# Altium project Marsault1.PrjPcb (part 1 of 7)
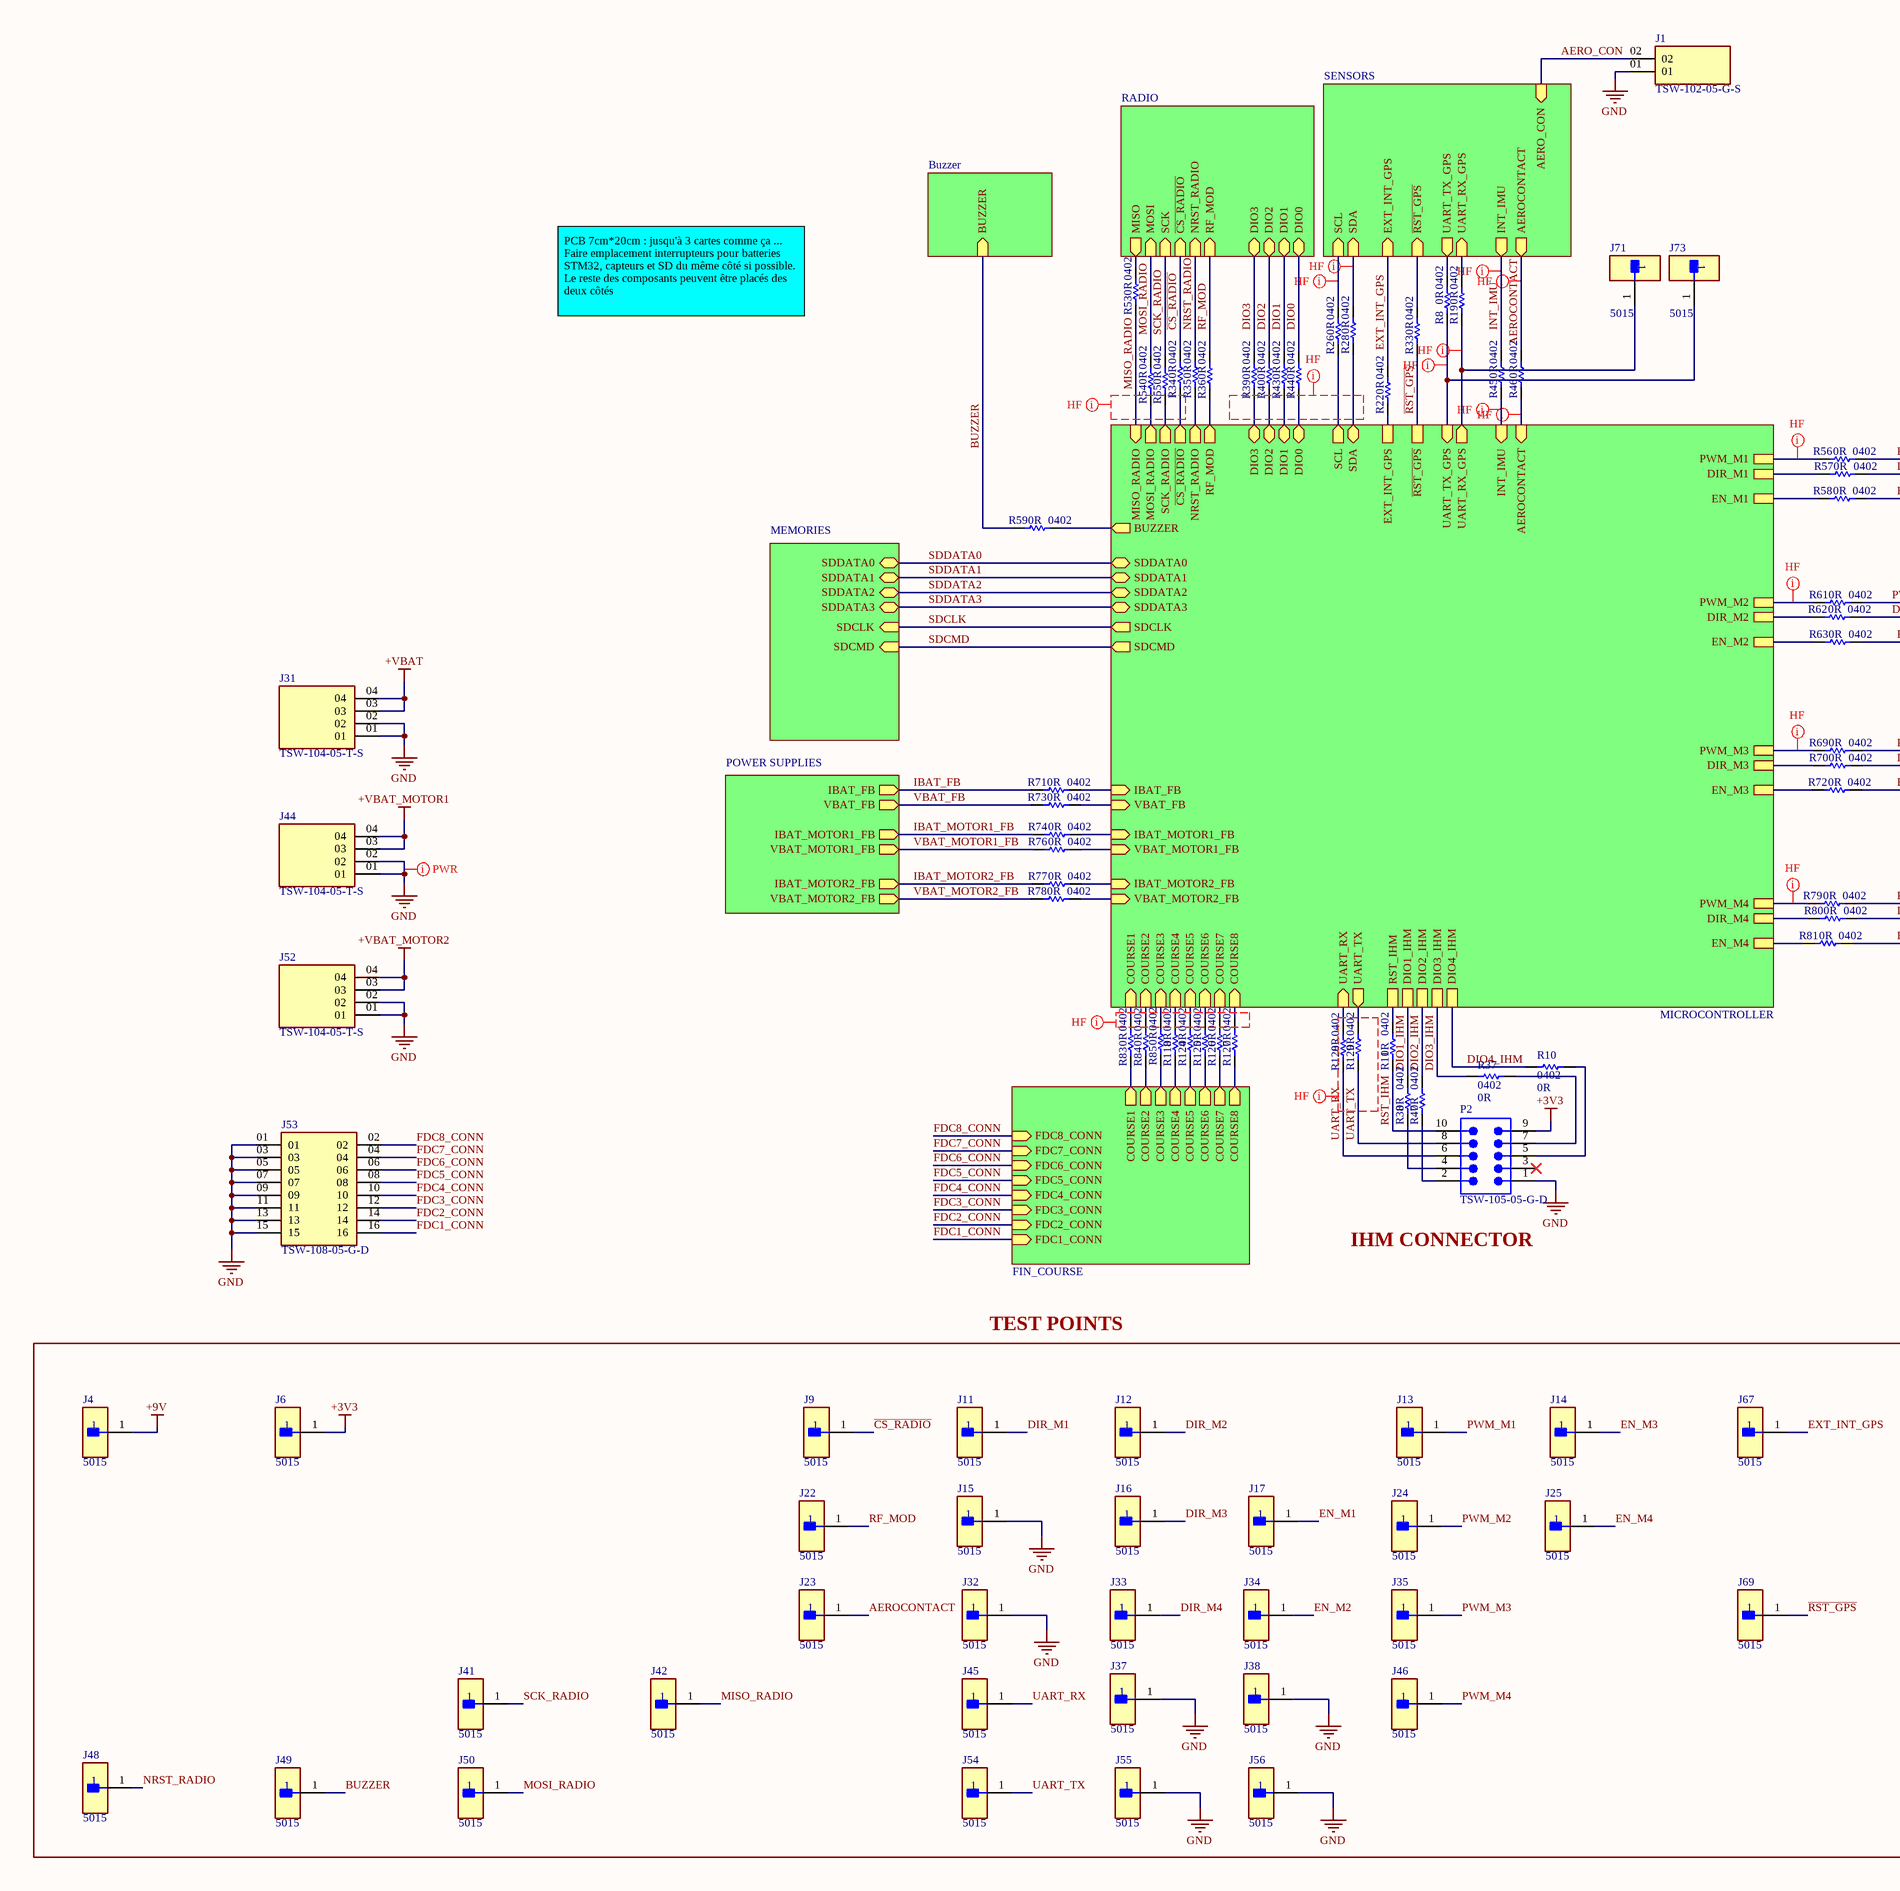
[diagram p0: MAIN.SchDoc, left]
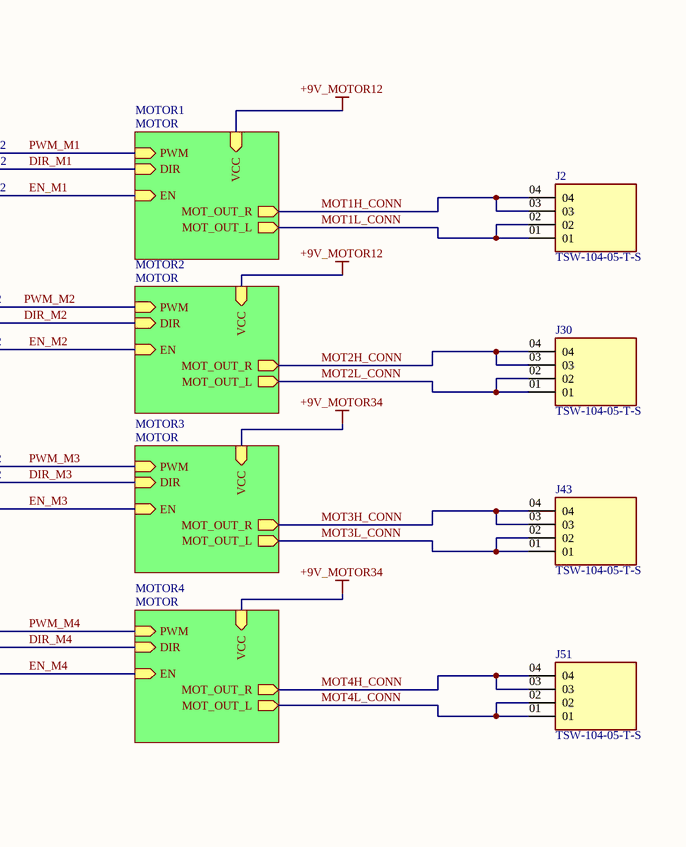
[diagram p1: MAIN.SchDoc, right]
9 sheets, 431 parts. Net scope: hierarchical (ports join the sheet entries above them; power ports are global).
Board file: PCB1.PcbDoc
Sheets:
  MAIN.SchDoc
    POWER SUPPLIES = POWER.SchDoc
    MEMORIES = MEMORIES.SchDoc
    MICROCONTROLLER = MICROCONTROLLER.SchDoc
    SENSORS = SENSORS.SchDoc
    MOTOR1 = MOTOR.SchDoc
    MOTOR2 = MOTOR.SchDoc
    MOTOR3 = MOTOR.SchDoc
    MOTOR4 = MOTOR.SchDoc
    RADIO = RADIO.SchDoc
    Buzzer = Buzzer.SchDoc
    FIN_COURSE = FIN_COURSE.SchDoc

## Sheet MAIN.SchDoc
size A2; SheetNumber: 1; SheetTotal: 9

### Parts
J1  TSW-102-05-G-S  [SAMTEC_TSW-102-05-G-S]
J2  TSW-104-05-T-S  [SAMTEC_TSW-104-05-T-S]
J4  5015  [FP-5015-MFG]
J6  5015  [FP-5015-MFG]
J9  5015  [FP-5015-MFG]
J11  5015  [FP-5015-MFG]
J12  5015  [FP-5015-MFG]
J13  5015  [FP-5015-MFG]
J14  5015  [FP-5015-MFG]
J15  5015  [FP-5015-MFG]
J16  5015  [FP-5015-MFG]
J17  5015  [FP-5015-MFG]
J22  5015  [FP-5015-MFG]
J23  5015  [FP-5015-MFG]
J24  5015  [FP-5015-MFG]
J25  5015  [FP-5015-MFG]
J30  TSW-104-05-T-S  [SAMTEC_TSW-104-05-T-S]
J31  TSW-104-05-T-S  [SAMTEC_TSW-104-05-T-S]
J32  5015  [FP-5015-MFG]
J33  5015  [FP-5015-MFG]
J34  5015  [FP-5015-MFG]
J35  5015  [FP-5015-MFG]
J37  5015  [FP-5015-MFG]
J38  5015  [FP-5015-MFG]
J41  5015  [FP-5015-MFG]
J42  5015  [FP-5015-MFG]
J43  TSW-104-05-T-S  [SAMTEC_TSW-104-05-T-S]
J44  TSW-104-05-T-S  [SAMTEC_TSW-104-05-T-S]
J45  5015  [FP-5015-MFG]
J46  5015  [FP-5015-MFG]
J48  5015  [FP-5015-MFG]
J49  5015  [FP-5015-MFG]
J50  5015  [FP-5015-MFG]
J51  TSW-104-05-T-S  [SAMTEC_TSW-104-05-T-S]
J52  TSW-104-05-T-S  [SAMTEC_TSW-104-05-T-S]
J53  TSW-108-05-G-D  [SAMTEC_TSW-108-05-G-D]
J54  5015  [FP-5015-MFG]
J55  5015  [FP-5015-MFG]
J56  5015  [FP-5015-MFG]
J67  5015  [FP-5015-MFG]
J69  5015  [FP-5015-MFG]
J71  5015  [FP-5015-MFG]
J73  5015  [FP-5015-MFG]
P2  TSW-105-05-G-D  [SMTC-TSW-105-05-X-D]
R8  Case Code (Imperial): 0402  Resistance: 0R  [RESC1005X40X25ML05T10]  (hidden comment: CRCW04020000Z0EDHP)
R10  Case Code (Imperial): 0402  Resistance: 0R  [RESC1005X40X25ML05T10]  (hidden comment: CRCW04020000Z0EDHP)
R11  Case Code (Imperial): 0402  Resistance: 0R  [RESC1005X40X25ML05T10]  (hidden comment: CRCW04020000Z0EDHP)
R19  Case Code (Imperial): 0402  Resistance: 0R  [RESC1005X40X25ML05T10]  (hidden comment: CRCW04020000Z0EDHP)
R22  Case Code (Imperial): 0402  Resistance: 0R  [RESC1005X40X25ML05T10]  (hidden comment: CRCW04020000Z0EDHP)
R26  Case Code (Imperial): 0402  Resistance: 0R  [RESC1005X40X25ML05T10]  (hidden comment: CRCW04020000Z0EDHP)
R28  Case Code (Imperial): 0402  Resistance: 0R  [RESC1005X40X25ML05T10]  (hidden comment: CRCW04020000Z0EDHP)
R33  Case Code (Imperial): 0402  Resistance: 0R  [RESC1005X40X25ML05T10]  (hidden comment: CRCW04020000Z0EDHP)
R34  Case Code (Imperial): 0402  Resistance: 0R  [RESC1005X40X25ML05T10]  (hidden comment: CRCW04020000Z0EDHP)
R35  Case Code (Imperial): 0402  Resistance: 0R  [RESC1005X40X25ML05T10]  (hidden comment: CRCW04020000Z0EDHP)
R36  Case Code (Imperial): 0402  Resistance: 0R  [RESC1005X40X25ML05T10]  (hidden comment: CRCW04020000Z0EDHP)
R37  Case Code (Imperial): 0402  Resistance: 0R  [RESC1005X40X25ML05T10]  (hidden comment: CRCW04020000Z0EDHP)
R38  Case Code (Imperial): 0402  Resistance: 0R  [RESC1005X40X25ML05T10]  (hidden comment: CRCW04020000Z0EDHP)
R39  Case Code (Imperial): 0402  Resistance: 0R  [RESC1005X40X25ML05T10]  (hidden comment: CRCW04020000Z0EDHP)
R40  Case Code (Imperial): 0402  Resistance: 0R  [RESC1005X40X25ML05T10]  (hidden comment: CRCW04020000Z0EDHP)
R43  Case Code (Imperial): 0402  Resistance: 0R  [RESC1005X40X25ML05T10]  (hidden comment: CRCW04020000Z0EDHP)
R44  Case Code (Imperial): 0402  Resistance: 0R  [RESC1005X40X25ML05T10]  (hidden comment: CRCW04020000Z0EDHP)
R45  Case Code (Imperial): 0402  Resistance: 0R  [RESC1005X40X25ML05T10]  (hidden comment: CRCW04020000Z0EDHP)
R46  Case Code (Imperial): 0402  Resistance: 0R  [RESC1005X40X25ML05T10]  (hidden comment: CRCW04020000Z0EDHP)
R47  Case Code (Imperial): 0402  Resistance: 0R  [RESC1005X40X25ML05T10]  (hidden comment: CRCW04020000Z0EDHP)
R53  Case Code (Imperial): 0402  Resistance: 0R  [RESC1005X40X25ML05T10]  (hidden comment: CRCW04020000Z0EDHP)
R54  Case Code (Imperial): 0402  Resistance: 0R  [RESC1005X40X25ML05T10]  (hidden comment: CRCW04020000Z0EDHP)
R55  Case Code (Imperial): 0402  Resistance: 0R  [RESC1005X40X25ML05T10]  (hidden comment: CRCW04020000Z0EDHP)
R56  Case Code (Imperial): 0402  Resistance: 0R  [RESC1005X40X25ML05T10]  (hidden comment: CRCW04020000Z0EDHP)
R57  Case Code (Imperial): 0402  Resistance: 0R  [RESC1005X40X25ML05T10]  (hidden comment: CRCW04020000Z0EDHP)
R58  Case Code (Imperial): 0402  Resistance: 0R  [RESC1005X40X25ML05T10]  (hidden comment: CRCW04020000Z0EDHP)
R59  Case Code (Imperial): 0402  Resistance: 0R  [RESC1005X40X25ML05T10]  (hidden comment: CRCW04020000Z0EDHP)
R61  Case Code (Imperial): 0402  Resistance: 0R  [RESC1005X40X25ML05T10]  (hidden comment: CRCW04020000Z0EDHP)
R62  Case Code (Imperial): 0402  Resistance: 0R  [RESC1005X40X25ML05T10]  (hidden comment: CRCW04020000Z0EDHP)
R63  Case Code (Imperial): 0402  Resistance: 0R  [RESC1005X40X25ML05T10]  (hidden comment: CRCW04020000Z0EDHP)
R69  Case Code (Imperial): 0402  Resistance: 0R  [RESC1005X40X25ML05T10]  (hidden comment: CRCW04020000Z0EDHP)
R70  Case Code (Imperial): 0402  Resistance: 0R  [RESC1005X40X25ML05T10]  (hidden comment: CRCW04020000Z0EDHP)
R71  Case Code (Imperial): 0402  Resistance: 0R  [RESC1005X40X25ML05T10]  (hidden comment: CRCW04020000Z0EDHP)
R72  Case Code (Imperial): 0402  Resistance: 0R  [RESC1005X40X25ML05T10]  (hidden comment: CRCW04020000Z0EDHP)
R73  Case Code (Imperial): 0402  Resistance: 0R  [RESC1005X40X25ML05T10]  (hidden comment: CRCW04020000Z0EDHP)
R74  Case Code (Imperial): 0402  Resistance: 0R  [RESC1005X40X25ML05T10]  (hidden comment: CRCW04020000Z0EDHP)
R76  Case Code (Imperial): 0402  Resistance: 0R  [RESC1005X40X25ML05T10]  (hidden comment: CRCW04020000Z0EDHP)
R77  Case Code (Imperial): 0402  Resistance: 0R  [RESC1005X40X25ML05T10]  (hidden comment: CRCW04020000Z0EDHP)
R78  Case Code (Imperial): 0402  Resistance: 0R  [RESC1005X40X25ML05T10]  (hidden comment: CRCW04020000Z0EDHP)
R79  Case Code (Imperial): 0402  Resistance: 0R  [RESC1005X40X25ML05T10]  (hidden comment: CRCW04020000Z0EDHP)
R80  Case Code (Imperial): 0402  Resistance: 0R  [RESC1005X40X25ML05T10]  (hidden comment: CRCW04020000Z0EDHP)
R81  Case Code (Imperial): 0402  Resistance: 0R  [RESC1005X40X25ML05T10]  (hidden comment: CRCW04020000Z0EDHP)
R83  Case Code (Imperial): 0402  Resistance: 0R  [RESC1005X40X25ML05T10]  (hidden comment: CRCW04020000Z0EDHP)
R84  Case Code (Imperial): 0402  Resistance: 0R  [RESC1005X40X25ML05T10]  (hidden comment: CRCW04020000Z0EDHP)
R85  Case Code (Imperial): 0402  Resistance: 0R  [RESC1005X40X25ML05T10]  (hidden comment: CRCW04020000Z0EDHP)
R118  Case Code (Imperial): 0402  Resistance: 0R  [RESC1005X40X25ML05T10]  (hidden comment: CRCW04020000Z0EDHP)
R124  Case Code (Imperial): 0402  Resistance: 0R  [RESC1005X40X25ML05T10]  (hidden comment: CRCW04020000Z0EDHP)
R125  Case Code (Imperial): 0402  Resistance: 0R  [RESC1005X40X25ML05T10]  (hidden comment: CRCW04020000Z0EDHP)
R126  Case Code (Imperial): 0402  Resistance: 0R  [RESC1005X40X25ML05T10]  (hidden comment: CRCW04020000Z0EDHP)
R127  Case Code (Imperial): 0402  Resistance: 0R  [RESC1005X40X25ML05T10]  (hidden comment: CRCW04020000Z0EDHP)
R128  Case Code (Imperial): 0402  Resistance: 0R  [RESC1005X40X25ML05T10]  (hidden comment: CRCW04020000Z0EDHP)
R129  Case Code (Imperial): 0402  Resistance: 0R  [RESC1005X40X25ML05T10]  (hidden comment: CRCW04020000Z0EDHP)

### Sub-sheets
Buzzer = Buzzer: BUZZER (in)
FIN_COURSE = FIN_COURSE: COURSE1 (out), COURSE8 (out), COURSE7 (out), COURSE6 (out), COURSE4 (out), COURSE2 (out), COURSE5 (out), COURSE3 (out), FDC8_CONN (in), FDC7_CONN (in), FDC6_CONN (in), FDC5_CONN (in), FDC4_CONN (in), FDC3_CONN (in), FDC2_CONN (in), FDC1_CONN (in)
MEMORIES = MEMORIES: SDDATA1 (bidir), SDCMD (in), SDDATA0 (bidir), SDDATA2 (bidir), SDCLK (in), SDDATA3 (bidir)
MICROCONTROLLER = MICROCONTROLLER: IBAT_FB (in), VBAT_FB (in), IBAT_MOTOR1_FB (in), VBAT_MOTOR1_FB (in), IBAT_MOTOR2_FB (in), VBAT_MOTOR2_FB (in), INT_IMU (in), DIO0 (bidir), DIO1 (bidir), DIO2 (bidir), DIO3 (bidir), RF_MOD (out), NRST_RADIO (out), ~{CS_RADIO} (out), SDDATA0 (bidir), SDDATA1 (bidir), SDDATA2 (bidir), SDDATA3 (bidir), SDCLK (out), SDCMD (out), AEROCONTACT (in), BUZZER (out), UART_RX (in), UART_TX (out), PWM_M1, DIR_M1, EN_M1, PWM_M2, DIR_M2, EN_M2, PWM_M3, DIR_M3, EN_M3, PWM_M4, DIR_M4, EN_M4, SCL (out), SDA (bidir), EXT_INT_GPS, ~{RST_GPS}, UART_TX_GPS (in), UART_RX_GPS (out), SCK_RADIO (out), MOSI_RADIO (out), MISO_RADIO (in), COURSE1 (in), COURSE2 (in), COURSE3 (in), COURSE4 (in), COURSE5 (in), COURSE6 (in), COURSE7 (in), COURSE8 (in), RST_IHM, DIO1_IHM, DIO2_IHM, DIO3_IHM, DIO4_IHM
MOTOR1 = MOTOR: DIR (in), PWM (in), EN (in), VCC (in), MOT_OUT_R (out), MOT_OUT_L (out)
MOTOR2 = MOTOR: EN (in), PWM (in), DIR (in), VCC (in), MOT_OUT_R (out), MOT_OUT_L (out)
MOTOR3 = MOTOR: EN (in), DIR (in), PWM (in), VCC (in), MOT_OUT_L (out), MOT_OUT_R (out)
MOTOR4 = MOTOR: PWM (in), EN (in), DIR (in), VCC (in), MOT_OUT_L (out), MOT_OUT_R (out)
POWER SUPPLIES = POWER: VBAT_FB (out), IBAT_MOTOR1_FB (out), VBAT_MOTOR1_FB (out), IBAT_FB (out), IBAT_MOTOR2_FB (out), VBAT_MOTOR2_FB (out)
RADIO = RADIO: ~{CS_RADIO} (in), DIO0 (bidir), DIO2 (bidir), NRST_RADIO (in), DIO1 (bidir), RF_MOD (in), DIO3 (bidir), SCK (in), MOSI (in), MISO (out)
SENSORS = SENSORS: INT_IMU (out), AEROCONTACT (out), SCL (in), SDA (in), EXT_INT_GPS (in), UART_TX_GPS (out), ~{RST_GPS} (in), UART_RX_GPS (in), AERO_CON (in)

### Nets
+3V3: J6.1 P2.9
+9V: J4.1
+9V_MOTOR12: sheet MOTOR1/VCC, sheet MOTOR2/VCC  [project net VCC_PWR]
+9V_MOTOR34: sheet MOTOR3/VCC, sheet MOTOR4/VCC  [project net VCC_PWR]
+VBAT: J31.03 J31.04
+VBAT_MOTOR1: J44.03 J44.04
+VBAT_MOTOR2: J52.03 J52.04
GND: J1.01 J15.1 J31.01 J31.02 J32.1 J37.1 J38.1 J44.01 J44.02 J52.01 J52.02 J53.01 J53.03 J53.05 J53.07 J53.09 J53.11 J53.13 J53.15 J55.1 J56.1 P2.1
~{CS_RADIO}: J9.1 R34.2 ; sheet RADIO/~{CS_RADIO}
~{RST_GPS}: J69.1 R33.1 ; sheet MICROCONTROLLER/~{RST_GPS}
~{RST_ihm}: R11.2 ; sheet MICROCONTROLLER/RST_IHM
AERO_CON: J1.02 ; sheet SENSORS/AERO_CON
AEROCONTACT: J23.1 R46.2 ; sheet SENSORS/AEROCONTACT
BUZZER: J49.1 R59.2 ; sheet Buzzer/BUZZER
DIO0: R44.2 ; sheet RADIO/DIO0
DIO1: R43.2 ; sheet RADIO/DIO1
DIO1_IHM: R38.2 ; sheet MICROCONTROLLER/DIO1_IHM
DIO2: R40.2 ; sheet RADIO/DIO2
DIO2_IHM: R47.2 ; sheet MICROCONTROLLER/DIO2_IHM
DIO3: R39.2 ; sheet RADIO/DIO3
DIO3_IHM: R37.2 ; sheet MICROCONTROLLER/DIO3_IHM
DIO4_IHM: R10.2 ; sheet MICROCONTROLLER/DIO4_IHM
DIR_M1: J11.1 R57.1 ; sheet MOTOR1/DIR
DIR_M2: J12.1 R62.1 ; sheet MOTOR2/DIR
DIR_M3: J16.1 R70.1 ; sheet MOTOR3/DIR
DIR_M4: J33.1 R80.1 ; sheet MOTOR4/DIR
EN_M1: J17.1 R58.1 ; sheet MOTOR1/EN
EN_M2: J34.1 R63.1 ; sheet MOTOR2/EN
EN_M3: J14.1 R72.1 ; sheet MOTOR3/EN
EN_M4: J25.1 R81.1 ; sheet MOTOR4/EN
EXT_INT_GPS: J67.1 R22.2 ; sheet SENSORS/EXT_INT_GPS
FDC1_CONN: J53.16 ; sheet FIN_COURSE/FDC1_CONN
FDC2_CONN: J53.14 ; sheet FIN_COURSE/FDC2_CONN
FDC3_CONN: J53.12 ; sheet FIN_COURSE/FDC3_CONN
FDC4_CONN: J53.10 ; sheet FIN_COURSE/FDC4_CONN
FDC5_CONN: J53.08 ; sheet FIN_COURSE/FDC5_CONN
FDC6_CONN: J53.06 ; sheet FIN_COURSE/FDC6_CONN
FDC7_CONN: J53.04 ; sheet FIN_COURSE/FDC7_CONN
FDC8_CONN: J53.02 ; sheet FIN_COURSE/FDC8_CONN
IBAT_FB: R71.2 ; sheet POWER SUPPLIES/IBAT_FB
IBAT_MOTOR1_FB: R74.2 ; sheet POWER SUPPLIES/IBAT_MOTOR1_FB
IBAT_MOTOR2_FB: R77.2 ; sheet POWER SUPPLIES/IBAT_MOTOR2_FB
INT_IMU: R45.2 ; sheet SENSORS/INT_IMU
MISO_RADIO: J42.1 R53.1 ; sheet MICROCONTROLLER/MISO_RADIO
MOSI_RADIO: J50.1 R54.2 ; sheet RADIO/MOSI
MOT1H_CONN: J2.03 J2.04 ; sheet MOTOR1/MOT_OUT_R  [project net HOT_R]
MOT1L_CONN: J2.01 J2.02 ; sheet MOTOR1/MOT_OUT_L  [project net HOT_L]
MOT2H_CONN: J30.03 J30.04 ; sheet MOTOR2/MOT_OUT_R  [project net HOT_R]
MOT2L_CONN: J30.01 J30.02 ; sheet MOTOR2/MOT_OUT_L  [project net HOT_L]
MOT3H_CONN: J43.03 J43.04 ; sheet MOTOR3/MOT_OUT_R  [project net HOT_R]
MOT3L_CONN: J43.01 J43.02 ; sheet MOTOR3/MOT_OUT_L  [project net HOT_L]
MOT4H_CONN: J51.03 J51.04 ; sheet MOTOR4/MOT_OUT_R  [project net HOT_R]
MOT4L_CONN: J51.01 J51.02 ; sheet MOTOR4/MOT_OUT_L  [project net HOT_L]
NRST_RADIO: J48.1 R35.2 ; sheet RADIO/NRST_RADIO
PWM_M1: J13.1 R56.1 ; sheet MOTOR1/PWM
PWM_M2: J24.1 R61.1 ; sheet MOTOR2/PWM
PWM_M3: J35.1 R69.1 ; sheet MOTOR3/PWM
PWM_M4: J46.1 R79.1 ; sheet MOTOR4/PWM
RF_MOD: J22.1 R36.2 ; sheet RADIO/RF_MOD
RST_IHM: P2.10 R11.1
SCK_RADIO: J41.1 R55.2 ; sheet RADIO/SCK
SDCLK: sheet MEMORIES/SDCLK, sheet MICROCONTROLLER/SDCLK
SDCMD: sheet MEMORIES/SDCMD, sheet MICROCONTROLLER/SDCMD
SDDATA0: sheet MEMORIES/SDDATA0, sheet MICROCONTROLLER/SDDATA0
SDDATA1: sheet MEMORIES/SDDATA1, sheet MICROCONTROLLER/SDDATA1
SDDATA2: sheet MEMORIES/SDDATA2, sheet MICROCONTROLLER/SDDATA2
SDDATA3: sheet MEMORIES/SDDATA3, sheet MICROCONTROLLER/SDDATA3
UART_RX: J45.1 P2.6 R128.1
UART_TX: J54.1 P2.8 R129.1
VBAT_FB: R73.2 ; sheet POWER SUPPLIES/VBAT_FB
VBAT_MOTOR1_FB: R76.2 ; sheet POWER SUPPLIES/VBAT_MOTOR1_FB
VBAT_MOTOR2_FB: R78.2 ; sheet POWER SUPPLIES/VBAT_MOTOR2_FB
NetIC9_8: R33.2 ; sheet SENSORS/~{RST_GPS}
NetIC9_20: R8.2 ; sheet SENSORS/UART_TX_GPS
NetIC9_21: R19.2 ; sheet SENSORS/UART_RX_GPS
NetIC10_11: R127.1 ; sheet FIN_COURSE/COURSE8
NetIC10_12: R126.1 ; sheet FIN_COURSE/COURSE7
NetIC10_13: R125.1 ; sheet FIN_COURSE/COURSE6
NetIC10_14: R124.1 ; sheet FIN_COURSE/COURSE5
NetIC10_15: R118.1 ; sheet FIN_COURSE/COURSE4
NetIC10_16: R85.1 ; sheet FIN_COURSE/COURSE3
NetIC10_17: R84.1 ; sheet FIN_COURSE/COURSE2
NetIC10_18: R83.1 ; sheet FIN_COURSE/COURSE1
NetJ70_1: R28.2 ; sheet SENSORS/SDA
NetJ71_1: J71.1 R19.1 ; sheet MICROCONTROLLER/UART_RX_GPS
NetJ72_1: R26.2 ; sheet SENSORS/SCL
NetJ73_1: J73.1 R8.1 ; sheet MICROCONTROLLER/UART_TX_GPS
NetP2_2: P2.2 R47.1
NetP2_4: P2.4 R38.1
NetP2_5: P2.5 R10.1
NetP2_7: P2.7 R37.1
NetR22_1: R22.1 ; sheet MICROCONTROLLER/EXT_INT_GPS
NetR26_1: R26.1 ; sheet MICROCONTROLLER/SCL
NetR28_1: R28.1 ; sheet MICROCONTROLLER/SDA
NetR34_1: R34.1 ; sheet MICROCONTROLLER/~{CS_RADIO}
NetR35_1: R35.1 ; sheet MICROCONTROLLER/NRST_RADIO
NetR36_1: R36.1 ; sheet MICROCONTROLLER/RF_MOD
NetR39_1: R39.1 ; sheet MICROCONTROLLER/DIO3
NetR40_1: R40.1 ; sheet MICROCONTROLLER/DIO2
NetR43_1: R43.1 ; sheet MICROCONTROLLER/DIO1
NetR44_1: R44.1 ; sheet MICROCONTROLLER/DIO0
NetR45_1: R45.1 ; sheet MICROCONTROLLER/INT_IMU
NetR46_1: R46.1 ; sheet MICROCONTROLLER/AEROCONTACT
NetR53_2: R53.2 ; sheet RADIO/MISO
NetR54_1: R54.1 ; sheet MICROCONTROLLER/MOSI_RADIO
NetR55_1: R55.1 ; sheet MICROCONTROLLER/SCK_RADIO
NetR56_2: R56.2 ; sheet MICROCONTROLLER/PWM_M1
NetR57_2: R57.2 ; sheet MICROCONTROLLER/DIR_M1
NetR58_2: R58.2 ; sheet MICROCONTROLLER/EN_M1
NetR59_1: R59.1 ; sheet MICROCONTROLLER/BUZZER
NetR61_2: R61.2 ; sheet MICROCONTROLLER/PWM_M2
NetR62_2: R62.2 ; sheet MICROCONTROLLER/DIR_M2
NetR63_2: R63.2 ; sheet MICROCONTROLLER/EN_M2
NetR69_2: R69.2 ; sheet MICROCONTROLLER/PWM_M3
NetR70_2: R70.2 ; sheet MICROCONTROLLER/DIR_M3
NetR71_1: R71.1 ; sheet MICROCONTROLLER/IBAT_FB
NetR72_2: R72.2 ; sheet MICROCONTROLLER/EN_M3
NetR73_1: R73.1 ; sheet MICROCONTROLLER/VBAT_FB
NetR74_1: R74.1 ; sheet MICROCONTROLLER/IBAT_MOTOR1_FB
NetR76_1: R76.1 ; sheet MICROCONTROLLER/VBAT_MOTOR1_FB
NetR77_1: R77.1 ; sheet MICROCONTROLLER/IBAT_MOTOR2_FB
NetR78_1: R78.1 ; sheet MICROCONTROLLER/VBAT_MOTOR2_FB
NetR79_2: R79.2 ; sheet MICROCONTROLLER/PWM_M4
NetR80_2: R80.2 ; sheet MICROCONTROLLER/DIR_M4
NetR81_2: R81.2 ; sheet MICROCONTROLLER/EN_M4
NetR83_2: R83.2 ; sheet MICROCONTROLLER/COURSE1
NetR84_2: R84.2 ; sheet MICROCONTROLLER/COURSE2
NetR85_2: R85.2 ; sheet MICROCONTROLLER/COURSE3
NetR118_2: R118.2 ; sheet MICROCONTROLLER/COURSE4
NetR124_2: R124.2 ; sheet MICROCONTROLLER/COURSE5
NetR125_2: R125.2 ; sheet MICROCONTROLLER/COURSE6
NetR126_2: R126.2 ; sheet MICROCONTROLLER/COURSE7
NetR127_2: R127.2 ; sheet MICROCONTROLLER/COURSE8
NetR128_2: R128.2 ; sheet MICROCONTROLLER/UART_RX
NetR129_2: R129.2 ; sheet MICROCONTROLLER/UART_TX

Not connected (* = marked no-connect by the designer): P2 3*

### Layout directives
net class HF: (no net found under the mark), AEROCONTACT, INT_IMU, NetJ70_1, NetJ71_1, NetJ72_1, NetJ73_1, NetR45_1, NetR46_1, NetR56_2, NetR61_2, NetR69_2, NetR79_2
net class PWR: GND

### Notes on the sheet
- PCB 7cm*20cm : jusqu'à 3 cartes comme ça ...
  Faire emplacement interrupteurs pour batteries
  STM32, capteurs et SD du même côté si possible. Le reste des composants peuvent être placés des deux côtés
- (near P2) IHM CONNECTOR
- TEST POINTS

### Library data of the parts
J1 = TSW-102-05-G-S: MF: {'manufacturer': u'Samtec Inc.'}; MP: TSW-102-05-G-S; Price: None; Package: None; Value: *; Availability: Unavailable
J2 J30 J31 J43 J44 J51 J52 = TSW-104-05-T-S: MF: {'manufacturer': u'Samtec'}; MP: TSW-104-05-T-S; Price: None; Package: None; Value: *; Availability: Unavailable
J4 J6 J9 J11-J17 J22-J25 J32-J35 J37 J38 J41 J42 J45 J46 J48-J50 J54-J56 J67 J69 J71 J73 = CMP-2000-05183-2: PC TEST POINT MINIATURE; Manufacturer: keystone; Number Of Contacts: 1; Conn Orientation: Straight; Category: Conn; Manufacturer Part Number: 5015; Digikey Description: PC TEST POINT MINIATURE; Automotive: No; Lead Free: Yes; Octopart: https://octopart.com/5015-keystone-3822; ComponentLink2URL: http://www.keyelco.com/product-pdf.cfm?p=1353; Package: 5015; RoHS: TRUE; Device Class L3: unset; Device Class L2: unset; Contact Material: Silver; Device Class L1: Connectors; Height: 1.65mm; ComponentLink2Description: Datasheet; Supplier 1: Mouser; Supplier Part Number 1: 534-5015; Stock 1: 1597055; Pricing 1: 1=0,45000, 10=0,43800, 25=0,36500, 50=0,36500, 100=0,30200, 250=0,27200, 500=0,25800, 1000=0,21300, 2000=0,19600, 5000=0,17200, 10000=0,17200 (USD); Mount: Surface Mount; Contact Plating: Silver,Tin,Lead; Material: Bronze,Silver; Color: White; Package Quantity: 1; Packaging: Tape and Reel; Series: -; Termination: Solder; Number of Ports: 1; Orientation: Straight; Length: 2.66mm; Depth: 1.01mm; Thickness: 0.01inch; REACH SVHC: No SVHC; RoHS Compliant: Yes; ComponentLink1URL: https://datasheet.ciiva.com/1123/5015-1123862.pdf?src-supplier=Newark; ComponentLink1Description: https://datasheet.ciiva.com/1123/5015-1123862.pdf?src-supplier=Newark; ComponentLink3URL: https://datasheet.ciiva.com/2917/5015-2917616.pdf?src-supplier=Digi-Key; ComponentLink3Description: https://datasheet.ciiva.com/2917/5015-2917616.pdf?src-supplier=Digi-Key; ComponentLink4URL: https://datasheet.ciiva.com/2917/5015-2917617.pdf?src-supplier=Digi-Key; ComponentLink4Description: https://datasheet.ciiva.com/2917/5015-2917617.pdf?src-supplier=Digi-Key; ComponentLink5URL: https://datasheet.ciiva.com/16883/70182998-16883734.pdf?src-supplier=Allied+Electronics; ComponentLink5Description: https://datasheet.ciiva.com/16883/70182998-16883734.pdf?src-supplier=Allied+Electronics
J53 = TSW-108-05-G-D: MF: {'manufacturer': u'Samtec'}; MP: TSW-108-05-G-D; Price: None; Package: None; Value: *; Availability: Unavailable
P2 = CMP-1024-00362-1: 0.025" SQ Post Header, Through-hole, Vertical, -55 to 125 degC, 2.54 mm Pitch, 10-Pin, Male, RoHS; Manufacturer: Samtec; Pitch: 2.54 mm; Temperature Range: -55 to 125 degC; ComponentLink3URL: http://www.samtec.com/documents/webfiles/cpdf/TSW-XXX-XX-XXX-X-XX-XXX-MKT.pdf; ComponentLink2Description: Datasheet; Mounting Technology: Through-hole; ComponentLink3Description: Package Specification; RoHS: True; ComponentLink1URL: http://www.samtec.com; PackageVersion: DM, 8/1988; PartNumber: TSW-105-05-G-D; PackageReference: TSW-105-05-X-D; DatasheetVersion: F-214; ComponentLink2URL: http://www.samtec.com/documents/webfiles/pdf/TSW_TH.PDF; PackageDescription: .025[0.64] SQ. Post Terminal Strip Assembly; Orientation: Vertical; ComponentLink1Description: Manufacturer URL
R8 R10 R11 R19 R22 R26 R28 R33-R40 R43-R47 R53-R59 R61-R63 R69-R74 R76-R81 R83-R85 R118 R124-R129 = CMP-2002-03041-1: Manufacturer: Vishay Dale; Voltage Rating: 50V; Power Rating: 200mW; Temperature Coefficient: 0ppm/°C; Max Power Dissipation: 125mW; Part Number: CRCW04020000Z0EDHP; Supplier 1: Mouser; Supplier Part Number 1: 71-CRCW04020000Z0EDH; Manufacturer Part Number: CRCW04020000Z0EDHP; RoHS: Yes; Category: Chip SMD Resistors; Stock 1: 2010; Pricing 1: 1=0,13000, 10=0,08600, 50=0,08600, 100=0,04000, 1000=0,01800, 10000=0,01200 (USD); Mount: Surface Mount; Case/Package: 0402; Case Code (Metric): 1005; Contact Plating: Tin; Weight: 2.3E-05oz; Size Code: 0402; Min Operating Temperature: -55°C; Max Operating Temperature: 155°C; Packaging: Tape and Reel; Resistor Type: Thick Film; Termination: SMD/SMT; Voltage Rating (DC): 50V; Package Quantity: 1; Series: CRCW-HP; Number of Terminations: 2; Technology: THICK FILM; Construction: Rectangular; Features: Automotive AEC-Q200; Length: 1mm; Width: 0.02inch; Height: 0.3mm; Depth: 0.5mm; Radiation Hardening: No; REACH SVHC: Unknown; RoHS Compliant: Yes; Military Standard: Not; Lead Free: Lead Free; ComponentLink1URL: https://datasheet.ciiva.com/16494/crcwhpe3-16494453.pdf?src-supplier=Future+Electronics; ComponentLink1Description: https://datasheet.ciiva.com/16494/crcwhpe3-16494453.pdf?src-supplier=Future+Electronics; ComponentLink2URL: https://datasheet.ciiva.com/2470/crcwhpe3-2470555.pdf?src-supplier=Digi-Key; ComponentLink2Description: https://datasheet.ciiva.com/2470/crcwhpe3-2470555.pdf?src-supplier=Digi-Key; ComponentLink3URL: https://datasheet.ciiva.com/5562/crcwhpe3-46056-5562315.pdf?src-supplier=Mouser; ComponentLink3Description: https://datasheet.ciiva.com/5562/crcwhpe3-46056-5562315.pdf?src-supplier=Mouser; ComponentLink4URL: https://datasheet.ciiva.com/9109/crcwhpe3-9109963.pdf?src-supplier=Avnet; ComponentLink4Description: https://datasheet.ciiva.com/9109/crcwhpe3-9109963.pdf?src-supplier=Avnet; ComponentLink5URL: https://datasheet.ciiva.com/2470/crcwhpe3-2470556.pdf?src-supplier=Digi-Key; ComponentLink5Description: https://datasheet.ciiva.com/2470/crcwhpe3-2470556.pdf?src-supplier=Digi-Key; ComponentLink6URL: https://datasheet.ciiva.com/28621/1912814-28621324.pdf?src-supplier=Element14; ComponentLink6Description: https://datasheet.ciiva.com/28621/1912814-28621324.pdf?src-supplier=Element14; ComponentLink7URL: https://datasheet.ciiva.com/2470/crcwhpe3-2470557.pdf?src-supplier=Digi-Key; ComponentLink7Description: https://datasheet.ciiva.com/2470/crcwhpe3-2470557.pdf?src-supplier=Digi-Key; ComponentLink8URL: https://datasheet.ciiva.com/7725/crcwhpe3-7725758.pdf?src-supplier=Element14; ComponentLink8Description: https://datasheet.ciiva.com/7725/crcwhpe3-7725758.pdf?src-supplier=Element14

## Sheet POWER.SchDoc
size A3; SheetNumber: 2; SheetTotal: 9
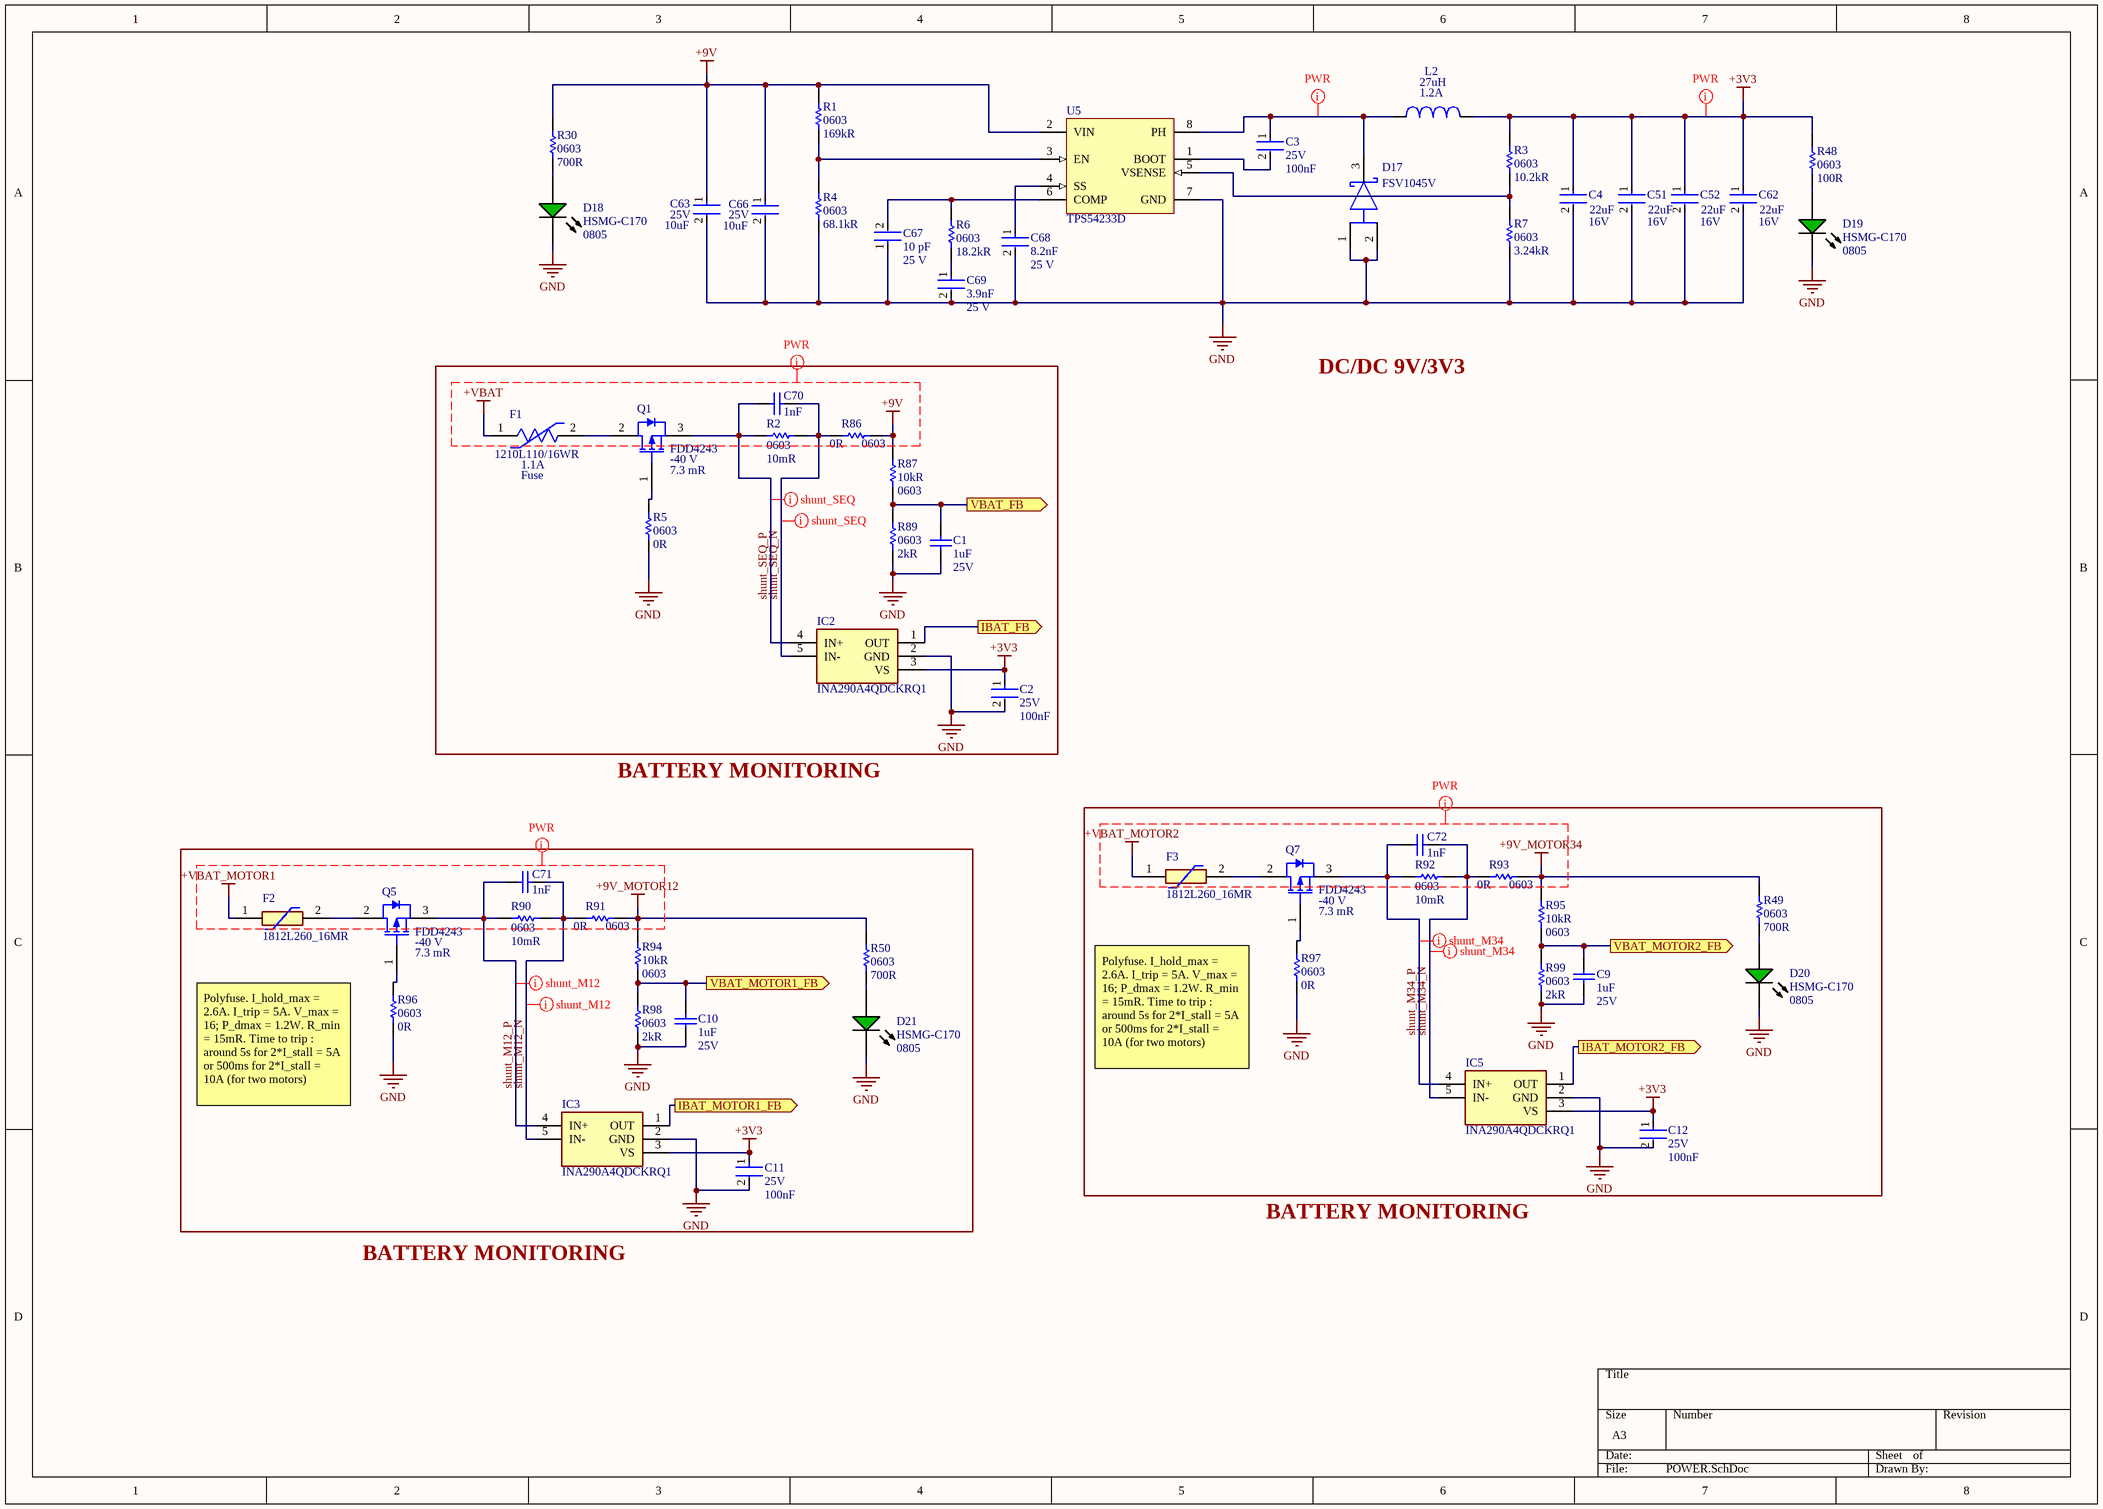
[diagram p2: POWER.SchDoc]

### Parts
C1  Capacitance: 1uF  Voltage Rating (DC): 25V  [CAPC1608X90X35LL15T15]  (hidden comment: C0603C105K3PAC7867)
C2  Voltage Rating (DC): 25V  Capacitance: 100nF  [FP-CGA3E-0_3-0_1-MFG]  (hidden comment: CGA3E2X7R1E104K080AA)
C3  Voltage Rating (DC): 25V  Capacitance: 100nF  [FP-CGA3E-0_3-0_1-MFG]  (hidden comment: CGA3E2X7R1E104K080AA)
C4  value 22uF  Voltage: 16V  [FP-C2012-125-MFG]  (hidden comment: C2012X5R1C226K125AC)
C9  Capacitance: 1uF  Voltage Rating (DC): 25V  [CAPC1608X90X35LL15T15]  (hidden comment: C0603C105K3PAC7867)
C10  Capacitance: 1uF  Voltage Rating (DC): 25V  [CAPC1608X90X35LL15T15]  (hidden comment: C0603C105K3PAC7867)
C11  Voltage Rating (DC): 25V  Capacitance: 100nF  [FP-CGA3E-0_3-0_1-MFG]  (hidden comment: CGA3E2X7R1E104K080AA)
C12  Voltage Rating (DC): 25V  Capacitance: 100nF  [FP-CGA3E-0_3-0_1-MFG]  (hidden comment: CGA3E2X7R1E104K080AA)
C51  value 22uF  Voltage: 16V  [FP-C2012-125-MFG]  (hidden comment: C2012X5R1C226K125AC)
C52  value 22uF  Voltage: 16V  [FP-C2012-125-MFG]  (hidden comment: C2012X5R1C226K125AC)
C62  value 22uF  Voltage: 16V  [FP-C2012-125-MFG]  (hidden comment: C2012X5R1C226K125AC)
C63  Voltage Rating (DC): 25V  Capacitance: 10uF  [FP-C2012-125-0_2-IPC_B]  (hidden comment: C2012X5R1E106K125AB)
C66  Voltage Rating (DC): 25V  Capacitance: 10uF  [FP-C2012-125-0_2-IPC_B]  (hidden comment: C2012X5R1E106K125AB)
C67  Capacitance: 10 pF  Voltage Rating: 25 V  [FP-C0603C-CF-MFG]  (hidden comment: C0603C100J3GACTU)
C68  value 8.2nF  Voltage Rating: 25 V  [FP-C0603C-CF-MFG]  (hidden comment: C0603C822K3RACTU)
C69  Capacitance: 3.9nF  Voltage Rating: 25 V  [FP-C0603C-CF-MFG]  (hidden comment: C0603C392K3RACTU)
C70  1nF  [SAMS-C0603-2_M]
C71  1nF  [SAMS-C0603-2_M]
C72  1nF  [SAMS-C0603-2_M]
D17  FSV1045V  [FP-340BQ-MFG]
D18  HSMG-C170  Case/Package: 0805  [AVAG-HSMX-C170_V]
D19  HSMG-C170  Case/Package: 0805  [AVAG-HSMX-C170_V]
D20  HSMG-C170  Case/Package: 0805  [AVAG-HSMX-C170_V]
D21  HSMG-C170  Case/Package: 0805  [AVAG-HSMX-C170_V]
F1  1210L110/16WR  Hold Current: 1.1A  Category: Fuse  [FP-1210L110-16WR-MFG]
F2  1812L260_16MR  [1812L010DR]
F3  1812L260_16MR  [1812L010DR]
IC2  INA290A4QDCKRQ1  [SOT65P210X110-5N]
IC3  INA290A4QDCKRQ1  [SOT65P210X110-5N]
IC5  INA290A4QDCKRQ1  [SOT65P210X110-5N]
L2  Inductance: 27uH  Max DC Current: 1.2A  [SRR6038]  (hidden comment: SRR6038-270Y)
Q1  FDD4243  VDS (max): -40 V  RDS (on) (max) (@10V): 7.3 mR  [INF-PG-TO252-3-313_L]
Q5  FDD4243  VDS (max): -40 V  RDS (on) (max) (@10V): 7.3 mR  [INF-PG-TO252-3-313_L]
Q7  FDD4243  VDS (max): -40 V  RDS (on) (max) (@10V): 7.3 mR  [INF-PG-TO252-3-313_L]
R1  Case Code (Imperial): 0603  Resistance: 169kR  [RESC1608X55X30ML15T15]  (hidden comment: ERJ-3EKF1693V)
R2  Case Code (Imperial): 0603  Resistance: 10mR  [RESC1508X46X38ML25T25]  (hidden comment: WSL0603R0100FEA)
R3  Case Code (Imperial): 0603  Resistance: 10.2kR  [RESC1608X55X30LL15T15]  (hidden comment: ERJ-3EKF1022V)
R4  Case Code (Imperial): 0603  Resistance: 68.1kR  [RESC1608X55X30ML15T15]  (hidden comment: ERJ-3EKF6812V)
R5  Case Code (Imperial): 0603  Resistance: 0R  [RESC1608X55X25ML10T15]  (hidden comment: RC0603JR-070RL)
R6  Case Code (Imperial): 0603  Resistance: 18.2kR  [RESC1608X55X30NL15T15]  (hidden comment: ERJ-3EKF1822V)
R7  Case Code (Imperial): 0603  Resistance: 3.24kR  [RESC1608X55X30ML15T15]  (hidden comment: ERJ-3EKF3241V)
R30  Case Code (Imperial): 0603  Resistance: 700R  [RESC1609X50X30NL10T20]  (hidden comment: CRCW060390R9FKEA)
R48  Case Code (Imperial): 0603  Resistance: 100R  [RESC1609X50X30NL10T20]  (hidden comment: CRCW060390R9FKEA)
R49  Case Code (Imperial): 0603  Resistance: 700R  [RESC1609X50X30NL10T20]  (hidden comment: CRCW060390R9FKEA)
R50  Case Code (Imperial): 0603  Resistance: 700R  [RESC1609X50X30NL10T20]  (hidden comment: CRCW060390R9FKEA)
R86  Case Code (Imperial): 0603  Resistance: 0R  [RESC1608X55X25ML10T15]  (hidden comment: RC0603JR-070RL)
R87  Resistance: 10kR  Case Code (Imperial): 0603  [RESC1609X55X30LL15T15]  (hidden comment: ERJ3EKF1002V)
R89  Case Code (Imperial): 0603  Resistance: 2kR  [RESC1608X55X30ML15T15]  (hidden comment: ERJ-3EKF2001V)
R90  Case Code (Imperial): 0603  Resistance: 10mR  [RESC1508X46X38ML25T25]  (hidden comment: WSL0603R0100FEA)
R91  Case Code (Imperial): 0603  Resistance: 0R  [RESC1608X55X25ML10T15]  (hidden comment: RC0603JR-070RL)
R92  Case Code (Imperial): 0603  Resistance: 10mR  [RESC1508X46X38ML25T25]  (hidden comment: WSL0603R0100FEA)
R93  Case Code (Imperial): 0603  Resistance: 0R  [RESC1608X55X25ML10T15]  (hidden comment: RC0603JR-070RL)
R94  Resistance: 10kR  Case Code (Imperial): 0603  [RESC1609X55X30LL15T15]  (hidden comment: ERJ3EKF1002V)
R95  Resistance: 10kR  Case Code (Imperial): 0603  [RESC1609X55X30LL15T15]  (hidden comment: ERJ3EKF1002V)
R96  Case Code (Imperial): 0603  Resistance: 0R  [RESC1608X55X25ML10T15]  (hidden comment: RC0603JR-070RL)
R97  Case Code (Imperial): 0603  Resistance: 0R  [RESC1608X55X25ML10T15]  (hidden comment: RC0603JR-070RL)
R98  Case Code (Imperial): 0603  Resistance: 2kR  [RESC1608X55X30ML15T15]  (hidden comment: ERJ-3EKF2001V)
R99  Case Code (Imperial): 0603  Resistance: 2kR  [RESC1608X55X30ML15T15]  (hidden comment: ERJ-3EKF2001V)
U5  TPS54233D  [D0008A_M]

### Ports
IBAT_FB (out), IBAT_MOTOR1_FB (out), IBAT_MOTOR2_FB (out), VBAT_FB (out), VBAT_MOTOR1_FB (out), VBAT_MOTOR2_FB (out)

### Nets
+3V3: C2.1 C4.1 C11.1 C12.1 C51.1 C52.1 C62.1 IC2.3(VS) IC3.3(VS) IC5.3(VS) L2.2 R3.2 R48.2
+9V: C63.1 C66.1 R1.2 R30.2 R86.2 R87.2 U5.2(VIN)
+9V_MOTOR12: R50.2 R91.2 R94.2  [project net VCC_PWR]
+9V_MOTOR34: R49.2 R93.2 R95.2  [project net VCC_PWR]
+VBAT: F1.1
+VBAT_MOTOR1: F2.1
+VBAT_MOTOR2: F3.1
GND: C1.1 C2.2 C4.2 C9.1 C10.1 C11.2 C12.2 C51.2 C52.2 C62.2 C63.2 C66.2 C67.1 C68.2 C69.2 D17.1(A) D17.2(A) D18.2(K) D19.2(K) D20.2(K) D21.2(K) IC2.2(GND) IC3.2(GND) IC5.2(GND) R4.1 R5.1 R7.1 R89.1 R96.1 R97.1 R98.1 R99.1 U5.7(GND)
IBAT_FB: IC2.1(OUT) ; port IBAT_FB
IBAT_MOTOR1_FB: IC3.1(OUT) ; port IBAT_MOTOR1_FB
IBAT_MOTOR2_FB: IC5.1(OUT) ; port IBAT_MOTOR2_FB
shunt_M12_N: C71.1 IC3.5(IN-) R90.2 R91.1
shunt_M12_P: C71.2 IC3.4(IN+) Q5.3(SOURCE) R90.1
shunt_M34_N: C72.1 IC5.5(IN-) R92.2 R93.1
shunt_M34_P: C72.2 IC5.4(IN+) Q7.3(SOURCE) R92.1
shunt_SEQ_N: C70.1 IC2.5(IN-) R2.2 R86.1
shunt_SEQ_P: C70.2 IC2.4(IN+) Q1.3(SOURCE) R2.1
VBAT_FB: C1.2 R87.1 R89.2 ; port VBAT_FB
VBAT_MOTOR1_FB: C10.2 R94.1 R98.2 ; port VBAT_MOTOR1_FB
VBAT_MOTOR2_FB: C9.2 R95.1 R99.2 ; port VBAT_MOTOR2_FB
NetC3_1: C3.1 D17.3(C) L2.1 U5.8(PH)
NetC3_2: C3.2 U5.1(BOOT)
NetC67_2: C67.2 R6.2 U5.6(COMP)
NetC68_1: C68.1 U5.4(SS)
NetC69_1: C69.1 R6.1
NetD18_1: D18.1(A) R30.1
NetD19_1: D19.1(A) R48.1
NetD20_1: D20.1(A) R49.1
NetD21_1: D21.1(A) R50.1
NetF1_2: F1.2 Q1.2(DRAIN)
NetF2_2: F2.2 Q5.2(DRAIN)
NetF3_2: F3.2 Q7.2(DRAIN)
NetQ1_1: Q1.1(GATE) R5.2
NetQ5_1: Q5.1(GATE) R96.2
NetQ7_1: Q7.1(GATE) R97.2
NetR1_1: R1.1 R4.2 U5.3(EN)
NetR3_1: R3.1 R7.2 U5.5(VSENSE)

### Layout directives
net class PWR: +3V3, +9V, +9V_MOTOR12, +9V_MOTOR34, +VBAT, +VBAT_MOTOR1, +VBAT_MOTOR2, NetC3_1
differential pair; differential pair class shunt_M12: shunt_M12_N, shunt_M12_P
differential pair; differential pair class shunt_SEQ: shunt_SEQ_N, shunt_SEQ_P
differential pair; differential pair class shunt_M34: shunt_M34_N, shunt_M34_P

### Notes on the sheet
- DC/DC 9V/3V3
- BATTERY MONITORING
- Polyfuse. I_hold_max = 2.6A. I_trip = 5A. V_max = 16; P_dmax = 1.2W. R_min = 15mR. Time to trip : around 5s for 2*I_stall = 5A or 500ms for 2*I_stall = 10A (for two motors)